# Altium project Enigma Rev A.PrjPCB (part 7 of 10)

## Sheet USB Phy.SchDoc: USB Phy
size Tabloid; ApprovedBy: NA; CompanyName: Cospan Design LLC; DrawnBy: Dave McCoy; Engineer: Dave McCoy; DocumentNumber: 8; Revision: A; SheetNumber: 8; SheetTotal: 20; Client: Public; Project: Enigma; ProjectPrettyName: Enigma
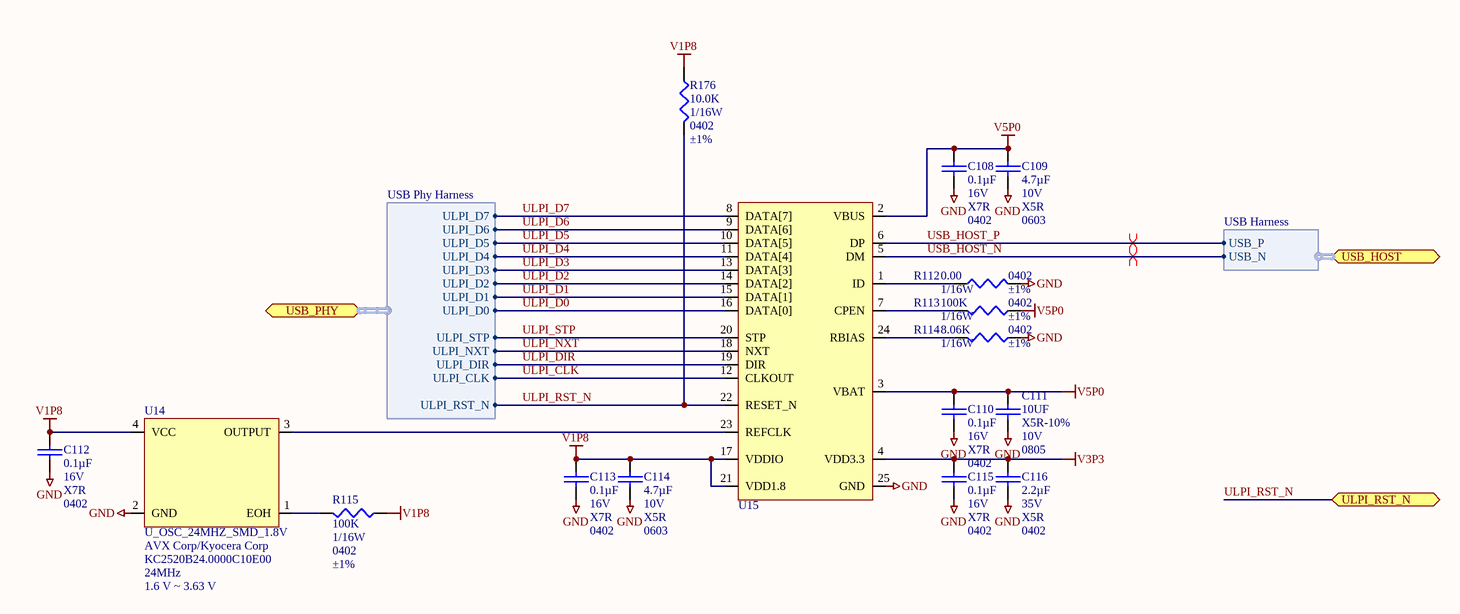
[diagram p13: USB Phy.SchDoc]

### Parts
C108  Capacitance: 0.1µF  Voltage - Rated: 16V  Temperature Coefficient: X7R  Package / Case: 0402  [C_0402]  (hidden comment: 0.1uF)
C109  Voltage - Rated: 10V  Temperature Coefficient: X5R  Package / Case: 0603  [C_ERA-0603]  (hidden comment: 4.7µF)
C110  Capacitance: 0.1µF  Voltage - Rated: 16V  Temperature Coefficient: X7R  Package / Case: 0402  [C_0402]  (hidden comment: 0.1uF)
C111  10UF  TOLERANCE: X5R-10%  VOLTS: 10V  FOOTPRINT: 0805  [C_0805]
C112  Capacitance: 0.1µF  Voltage - Rated: 16V  Temperature Coefficient: X7R  Package / Case: 0402  [C_0402]  (hidden comment: 0.1uF)
C113  Capacitance: 0.1µF  Voltage - Rated: 16V  Temperature Coefficient: X7R  Package / Case: 0402  [C_0402]  (hidden comment: 0.1uF)
C114  Voltage - Rated: 10V  Temperature Coefficient: X5R  Package / Case: 0603  [C_ERA-0603]  (hidden comment: 4.7µF)
C115  Capacitance: 0.1µF  Voltage - Rated: 16V  Temperature Coefficient: X7R  Package / Case: 0402  [C_0402]  (hidden comment: 0.1uF)
C116  Capacitance: 2.2µF  Voltage - Rated: 35V  Temperature Coefficient: X5R  Package / Case: 0402  [C_ERA-0402]  (hidden comment: C_0402_2.2uF_35V)
R112  Resistance In Ohms: 0.00  Power (Watts): 1/16W  Case: 0402  Tolerance: ±1%  [R_0402]  (hidden comment: 0.0 Ohms)
R113  Resistance In Ohms: 100K  Power (Watts): 1/16W  Case: 0402  Tolerance: ±1%  [R_0402]  (hidden comment: R_0402_100K)
R114  Resistance In Ohms: 8.06K  Power (Watts): 1/16W  Case: 0402  Tolerance: ±1%  [R_0402]  (hidden comment: R_0402_8.06K)
R115  Resistance In Ohms: 100K  Power (Watts): 1/16W  Case: 0402  Tolerance: ±1%  [R_0402]  (hidden comment: R_0402_100K)
R176  Resistance In Ohms: 10.0K  Power (Watts): 1/16W  Case: 0402  Tolerance: ±1%  [R_0402]  (hidden comment: R_0402_10.0K)
U14  U_OSC_24MHZ_SMD_1.8V  Manufacturer: AVX Corp/Kyocera Corp  Manufacturer Part Number: KC2520B24.0000C10E00  Frequency: 24MHz  Voltage - Supply: 1.6 V ~ 3.63 V  [OSC_KC5032A]
U15  U_USB3315C  [QFN50P400X400X100_HS-25N]  (value not drawn)

### Ports
ULPI_RST_N, USB_HOST (harness USB Harness), USB_PHY (harness USB Phy Harness)

### Harnesses
USB Phy Harness: ULPI_D7, ULPI_D6, ULPI_D5, ULPI_D4, ULPI_D3, ULPI_D2, ULPI_D1, ULPI_D0, ULPI_STP, ULPI_NXT, ULPI_DIR, ULPI_CLK, ULPI_RST_N
USB Harness: USB_P, USB_N

### Nets
GND: C108.1 C109.1 C110.1 C111.1 C112.1 C113.1 C114.1 C115.1 C116.1 R112.1 R114.2 U14.2(GND) U15.25(GND)
V1P8: C112.2 C113.2 C114.2 R115.2 R176.2 U14.4(VCC) U15.17(VDDIO) U15.21(VDD1.8)
V3P3: C115.2 C116.2 U15.4(VDD3.3)
V5P0: C108.2 C109.2 C110.2 C111.2 R113.2 U15.2(VBUS) U15.3(VBAT)
ULPI_CLK: U15.12(CLKOUT) ; port USB_PHY.ULPI_CLK
ULPI_D0: U15.16(DATA[0]) ; port USB_PHY.ULPI_D0
ULPI_D1: U15.15(DATA[1]) ; port USB_PHY.ULPI_D1
ULPI_D2: U15.14(DATA[2]) ; port USB_PHY.ULPI_D2
ULPI_D3: U15.13(DATA[3]) ; port USB_PHY.ULPI_D3
ULPI_D4: U15.11(DATA[4]) ; port USB_PHY.ULPI_D4
ULPI_D5: U15.10(DATA[5]) ; port USB_PHY.ULPI_D5
ULPI_D6: U15.9(DATA[6]) ; port USB_PHY.ULPI_D6
ULPI_D7: U15.8(DATA[7]) ; port USB_PHY.ULPI_D7
ULPI_DIR: U15.19(DIR) ; port USB_PHY.ULPI_DIR
ULPI_NXT: U15.18(NXT) ; port USB_PHY.ULPI_NXT
ULPI_RST_N: R176.1 U15.22(RESET_N) ; port ULPI_RST_N, port USB_PHY.ULPI_RST_N
ULPI_STP: U15.20(STP) ; port USB_PHY.ULPI_STP
USB_HOST_N: U15.5(DM) ; port USB_HOST.USB_N
USB_HOST_P: U15.6(DP) ; port USB_HOST.USB_P
NetR112_2: R112.2 U15.1(ID)
NetR113_1: R113.1 U15.7(CPEN)
NetR114_1: R114.1 U15.24(RBIAS)
NetR115_1: R115.1 U14.1(EOH)
NetU14_3: U14.3(OUTPUT) U15.23(REFCLK)

### Layout directives
differential pair: USB_HOST_N, USB_HOST_P

### Notes on the sheet
- Project:
- http://www.cospandesign.com
- Cospan Design
- Document:
- Engineer:
- Title:
- Client:
- Approved By:
- Revision:
- Date:
- Number:
- of

### Library data of the parts
C108 C110 C112 C113 C115 = C_0402_0.1UF_16V: as C81 on sheet USB Hub; Supplier 1: Digi-Key; RoHS: RoHS Compliant; Category: Capacitors; Stock 1: 18103134; Pricing 1: 1=0.1, 10=0.014, 100=0.0062, 500=0.00442, 1000=0.00348, 2500=0.00316, 5000=0.00291 (USD); Packaging: Cut Tape (CT); Part Status: Active; Operating Temperature: -55°C ~ 125°C; Features: -; Ratings: -; Applications: General Purpose; Mounting Type: Surface Mount, MLCC; Size / Dimension: 0.039" L x 0.020" W (1.00mm x 0.50mm); Height - Seated (Max): -; Thickness (Max): 0.022" (0.55mm); Lead Spacing: -; ComponentLink1URL: http://www.murata.com/~/media/webrenewal/support/library/catalog/products/capacitor/mlcc/c02e.ashx?la=en-us; ComponentLink1Description: http://www.murata.com/~/media/webrenewal/support/library/catalog/products/capacitor/mlcc/c02e.ashx?la=en-us; Supplier Part Number 1: 490-6328-1-ND
C109 C114 = C_0603_4.7uF_10V: CAP CER 4.7UF 10V X5R 0603; Manufacturer: Murata Electronics North America; Manufacturer Part Number: GRM188R61A475KE15D; Tolerance: ±10%; Supplier 1: Digi-Key; RoHS: RoHS Compliant; Category: Capacitors; Stock 1: 163304; Pricing 1: 1=0.15, 10=0.105, 100=0.0495, 500=0.03472, 1000=0.02875 (USD); Mounting Type: Surface Mount, MLCC; Operating Temperature: -55°C ~ 85°C; Features: Derating Recommended; Applications: General Purpose; Ratings: -; Size / Dimension: 0.063" L x 0.032" W (1.60mm x 0.80mm); Lead Spacing: -; Packaging: Cut Tape (CT); Lead Style: -; ComponentLink1URL: http://search.murata.co.jp/Ceramy/image/img/A01X/G101/ENG/GRM188R61A475KE15-01.pdf; ComponentLink1Description: http://search.murata.co.jp/Ceramy/image/img/A01X/G101/ENG/GRM188R61A475KE15-01.pdf; Supplier Part Number 1: 490-10477-1-ND; Capacitance: 4.7µF; Part Status: Active; Height - Seated (Max): -; Thickness (Max): 0.039" (1.00mm)
C111 = C_0805_10UF_10V: CAP CER 10UF 10V 10% X5R 0805; Manufacturer: Murata Electronics North America; Manufacturer Part Number: GRM21BR61A106KE19L; Capacitance: 10µF; TEMPERATURE: -55/85C; Supplier 1: Digi-Key; Supplier Part Number 1: 490-1709-1-ND; RoHS: RoHS Compliant; Category: Capacitors; Stock 1: 541107; Pricing: 1=0.21, 10=0.144, 50=0.0876, 100=0.0735, 250=0.05952, 500=0.0525, 1000=0.04463 (USD); Packaging: Cut Tape (CT); Voltage - Rated: 10V; Temperature Coefficient: X5R; Mounting Type: Surface Mount, MLCC; Operating Temperature: -55°C ~ 85°C; Applications: General Purpose; Ratings: -; Package / Case: 0805 (2012 Metric); Size / Dimension: 0.079" L x 0.049" W (2.00mm x 1.25mm); Height - Seated (Max): -; Thickness (Max): 0.053" (1.35mm); Lead Spacing: -; Features: -; Lead Style: -; ComponentLink1URL: http://www.murata.com/products/catalog/pdf/c02e.pdf; ComponentLink1Description: http://www.murata.com/products/catalog/pdf/c02e.pdf
C116 = C_0402_2.2uF_35V: CAP CER 2.2UF 35V 20% X5R 0402; Manufacturer: TDK Corporation; Manufacturer Part Number: C1005X5R1V225K050BC; Tolerance: ±10%; Description: CAP CER 2.2UF 35V X5R 0402; Supplier 1: Digi-Key; Supplier Part Number 1: 445-9028-1-ND; RoHS: RoHS Compliant; Category: Capacitors; Stock 1: 300469; Packaging: Cut Tape (CT); Mounting Type: Surface Mount, MLCC; Operating Temperature: -55°C ~ 85°C; Applications: General Purpose; Ratings: -; Size / Dimension: 0.039" L x 0.020" W (1.00mm x 0.50mm); Height - Seated (Max): -; Thickness (Max): 0.022" (0.55mm); Lead Spacing: -; Features: Low ESL; Lead Style: -; ComponentLink1URL: https://product.tdk.com/info/en/catalog/datasheets/mlcc_commercial_general_en.pdf; ComponentLink1Description: https://product.tdk.com/info/en/catalog/datasheets/mlcc_commercial_general_en.pdf; Pricing 1: 1=0.36, 10=0.253, 100=0.1518, 500=0.11386, 1000=0.09614, 2500=0.09108, 5000=0.08602 (USD); Part Status: Active; Failure Rate: -
R112 = R_0402_0.00: RES SMD 0.0OHM JUMPER 1/10W 0402; Manufacturer: Panasonic - ECG; Manufacturer Part Number: ERJ-2GE0R00X; Resistance (Ohms): 0.0; Supplier 1: Digi-Key; Supplier Part Number 1: P0.0JCT-ND; RoHS: RoHS Compliant; Category: Resistors; Stock 1: 9828264; Pricing: 1=0.05, 50=0.0172, 100=0.0131, 250=0.00976, 500=0.0072, 1000=0.0048, 5000=0.00338 (USD); Composition: Thick Film; Features: -; Temperature Coefficient: -; Package / Case: 0402 (1005 Metric); Size / Dimension: 0.039" L x 0.020" W (1.00mm x 0.50mm); Height: 0.016" (0.40mm); Number of Terminations: 2; Packaging: Cut Tape (CT); ComponentLink1URL: http://industrial.panasonic.com/www-cgi/jvcr13pz.cgi?E+PZ+3+AOA0001+ERJ2GE0R00X+7+WW; ComponentLink1Description: http://industrial.panasonic.com/www-cgi/jvcr13pz.cgi?E+PZ+3+AOA0001+ERJ2GE0R00X+7+WW
R113 R115 = R_0402_100K: RES SMD 100K OHM 1% 1/16W 0402; Manufacturer: Yageo; Manufacturer Part Number: RC0402FR-07100KL; Temperature Coefficient: ±100ppm/°C; Supplier 1: Digi-Key; RoHS: RoHS Compliant; Category: Resistors; Stock 1: 4989982; Pricing 1: 1=0.1, 10=0.013, 25=0.0096, 100=0.0054, 250=0.00412, 500=0.00328, 1000=0.00242, 2500=0.0021, 5000=0.00173 (USD); Packaging: Cut Tape (CT); Resistance (Ohms): 100k; Composition: Thick Film; Features: Moisture Resistant; Operating Temperature: -55°C ~ 155°C; Package / Case: 0402 (1005 Metric); Supplier Device Package: 0402; Size / Dimension: 0.039" L x 0.020" W (1.00mm x 0.50mm); Height: 0.016" (0.40mm); Number of Terminations: 2; ComponentLink1URL: http://www.yageo.com/NewPortal/yageodocoutput?fileName=/pdf/R-Chip/PYu-RC_Group_51_RoHS_L_3.pdf; ComponentLink1Description: http://www.yageo.com/NewPortal/yageodocoutput?fileName=/pdf/R-Chip/PYu-RC_Group_51_RoHS_L_3.pdf; Supplier Part Number 1: 311-100KLRCT-ND
R114 = R_0402_8.06K: RES 8.06K OHM 1/16W 1% 0402 SMD; Manufacturer: Yageo; Manufacturer Part Number: RC0402FR-078K06L; Temperature Coefficient: ±100ppm/°C; Supplier 1: Digi-Key; Supplier Part Number 1: 311-8.06KLRCT-ND; RoHS: RoHS Compliant; Category: Resistors; Stock 1: 102694; Pricing: 10=0.014, 50=0.0104, 100=0.0079, 250=0.00584, 500=0.00432, 1000=0.00288 (USD); Resistance (Ohms): 8.06K; Composition: Thick Film; Features: -; Size / Dimension: 0.039" L x 0.020" W (1.00mm x 0.50mm); Height: 0.016" (0.40mm); Number of Terminations: 2; Packaging: Cut Tape (CT); Package / Case: 0402 (1005 Metric); ComponentLink1URL: http://www.yageo.com/documents/recent/PYu-RC0402_51_RoHS_L_6.pdf; ComponentLink1Description: http://www.yageo.com/documents/recent/PYu-RC0402_51_RoHS_L_6.pdf
R176 = R_0402_10.0K: as R87 on sheet USB Hub; Supplier 1: Digi-Key; Supplier Part Number 1: RMCF0402FT10K0CT-ND; RoHS: RoHS Compliant; Category: Resistors; Stock 1: 234525; Pricing: 1=0.04, 10=0.025, 50=0.0138, 100=0.0105, 250=0.0078, 500=0.00576, 1000=0.00384, 2500=0.00324, 5000=0.0027 (USD); Composition: Thick Film; Features: -; Package / Case: 0402 (1005 Metric); Size / Dimension: 0.039" L x 0.020" W (1.00mm x 0.50mm); Height: 0.016" (0.40mm); Number of Terminations: 2; Packaging: Cut Tape (CT); ComponentLink1URL: http://www.seielect.com/Catalog/SEI-RMCF_RMCP.pdf; ComponentLink1Description: http://www.seielect.com/Catalog/SEI-RMCF_RMCP.pdf
U14 = U_OSC_24MHZ_SMD_1.8V: 24MHz CMOS XO (Standard) Oscillator; Function: Standby (Power Down); Frequency Stability: ±50ppm; Current - Supply (Max): 5mA; Current - Supply (Disable) (Max): 10µA; Supplier 1: Digi-Key; RoHS: RoHS Compliant; Category: Crystals, Oscillators, Resonators; Stock 1: 6138; Pricing 1: 1=1.41, 10=1.348, 50=1.3168, 100=1.1286, 500=1.09726, 1000=0.92483 (USD); Packaging: Cut Tape (CT); Part Status: Active; Type: XO (Standard); Output: CMOS; Operating Temperature: -10°C ~ 70°C; Ratings: -; Mounting Type: Surface Mount; Package / Case: 4-SMD, No Lead; Size / Dimension: 0.098" L x 0.079" W (2.50mm x 2.00mm); Height - Seated (Max): 0.028" (0.70mm); ComponentLink1URL: http://global.kyocera.com/prdct/electro/product/pdf/kc2520b_c1_e.pdf; ComponentLink1Description: http://global.kyocera.com/prdct/electro/product/pdf/kc2520b_c1_e.pdf; Supplier Part Number 1: 478-4778-1-ND
U15 = U_USB3315C: IC TXRX USB FLEXPWR 24QFN; Manufacturer: Microchip Technology; Manufacturer Part Number: USB3315C-CP-TR; Protocol: USB 2.0; Number of Drivers/Receivers: 1/1; Voltage - Supply: 1.8 V ~ 3.3 V; Supplier 1: Digi-Key; RoHS: RoHS Compliant; Category: Integrated Circuits (ICs); Stock 1: 12400; Pricing 1: 1=1.28, 25=1.0712, 100=0.9682 (USD); Packaging: Cut Tape (CT); Part Status: Active; Type: Transceiver; Duplex: -; Data Rate: -; Operating Temperature: -40°C ~ 85°C; Mounting Type: Surface Mount; Package / Case: 24-VFQFN Exposed Pad; Supplier Device Package: 24-QFN (4x4); ComponentLink1URL: http://www.microchip.com/mymicrochip/filehandler.aspx?ddocname=en562026; ComponentLink1Description: http://www.microchip.com/mymicrochip/filehandler.aspx?ddocname=en562026; Supplier Part Number 1: USB3315C-CP-CT-ND

## Sheet FMC 400 Pin.SchDoc: Altium FMC Sheet
size A3; Date: 8/14/2017; ApprovedBy: NA; CompanyName: Cospan Design LLC; DrawnBy: Altium; Engineer: Altium; DocumentNumber: 16; Revision: A; SheetNumber: 16; SheetTotal: 20; Project: Enigma; SheetName: Altium FMC Sheet; ProjectPrettyName: Enigma; Client: Public
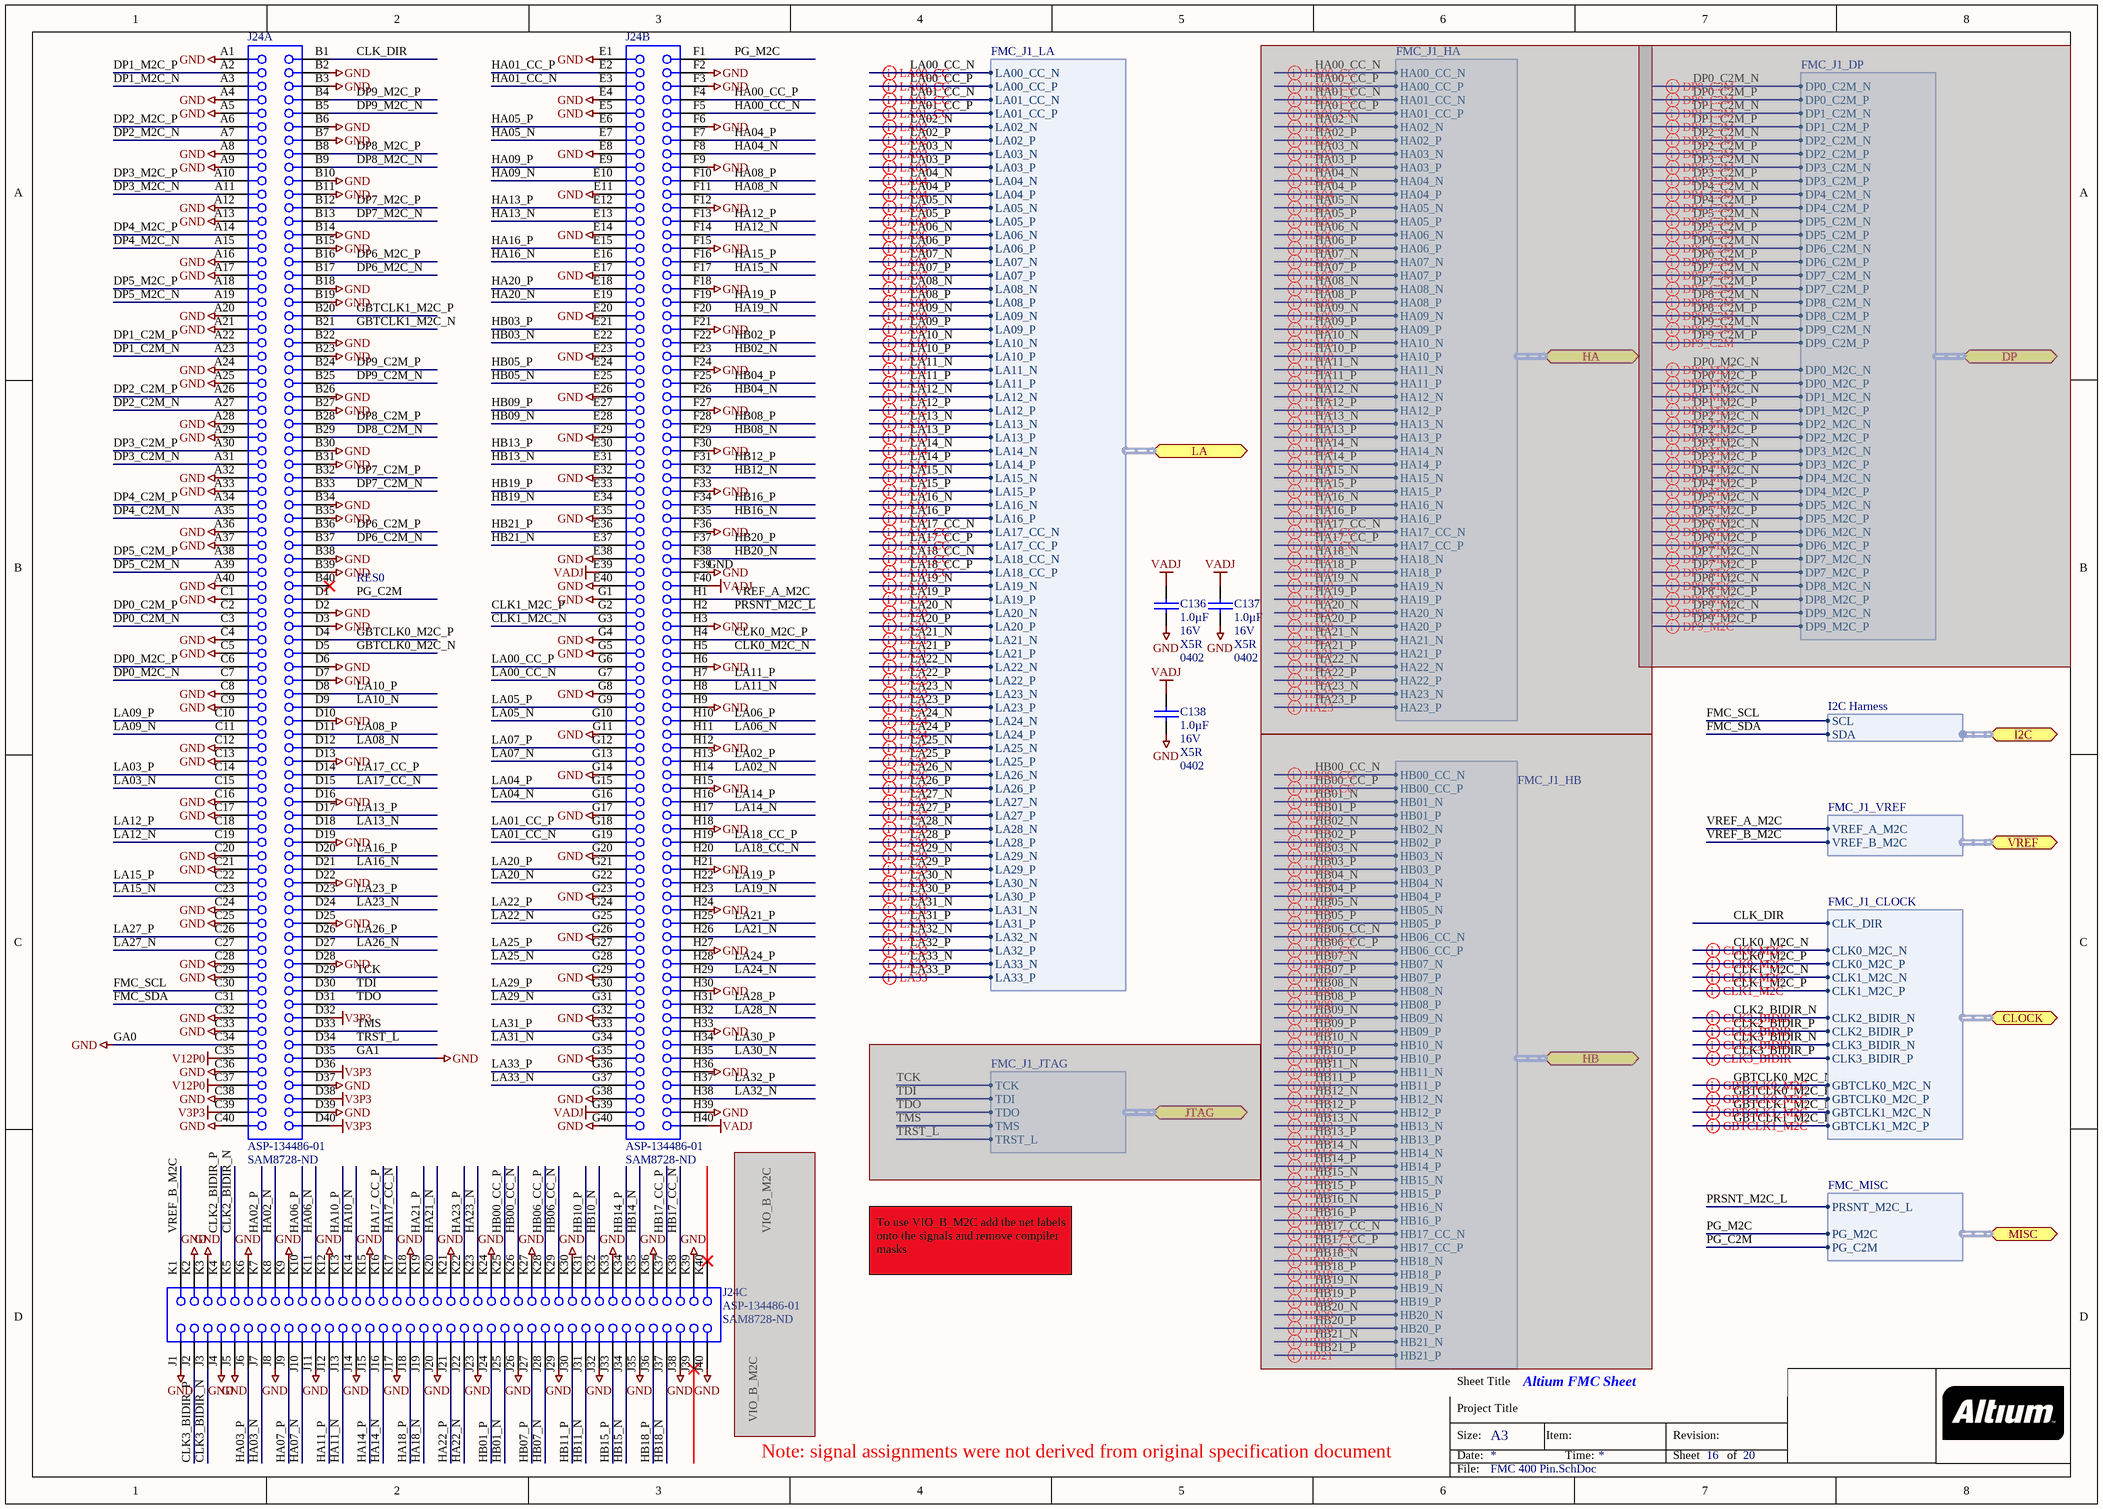
[diagram p14: FMC 400 Pin.SchDoc]

### Parts
C136  Capacitance: 1.0µF  Voltage - Rated: 16V  Temperature Coefficient: X5R  Package / Case: 0402  [C_ERA-0402]  (hidden comment: 1.0uF)
C137  Capacitance: 1.0µF  Voltage - Rated: 16V  Temperature Coefficient: X5R  Package / Case: 0402  [C_ERA-0402]  (hidden comment: 1.0uF)
C138  Capacitance: 1.0µF  Voltage - Rated: 16V  Temperature Coefficient: X5R  Package / Case: 0402  [C_ERA-0402]  (hidden comment: 1.0uF)
J24  ASP-134486-01  Supplier Part Number 1: SAM8728-ND  [BTB-SM1-27-2V400F]  (parts A,B,C of 3)

### Ports
CLOCK (harness FMC_J1_CLOCK), DP (harness FMC_J1_DP), HA (harness FMC_J1_HA), HB (harness FMC_J1_HB), I2C (harness I2C Harness), JTAG (harness FMC_J1_JTAG), LA (harness FMC_J1_LA), MISC (harness FMC_MISC), VREF (harness FMC_J1_VREF)

### Harnesses
FMC_J1_DP: DP1_C2M_N, DP1_C2M_P, DP1_M2C_N, DP1_M2C_P, DP2_C2M_N, DP2_C2M_P, DP2_M2C_N, DP2_M2C_P, DP3_C2M_N, DP3_C2M_P, DP3_M2C_N, DP3_M2C_P, DP4_C2M_N, DP4_C2M_P, DP4_M2C_N, DP4_M2C_P, DP5_C2M_N, DP5_C2M_P, DP5_M2C_N, DP5_M2C_P, DP6_C2M_N, DP6_C2M_P, DP6_M2C_N, DP6_M2C_P, DP7_C2M_N, DP7_C2M_P, DP7_M2C_N, DP7_M2C_P, DP8_C2M_N, DP8_C2M_P, DP8_M2C_N, DP8_M2C_P, DP9_C2M_N, DP9_C2M_P, DP9_M2C_N, DP9_M2C_P, DP0_C2M_N, DP0_C2M_P, DP0_M2C_N, DP0_M2C_P
FMC_J1_LA: LA05_N, LA05_P, LA06_N, LA06_P, LA09_N, LA09_P, LA10_N, LA10_P, LA13_N, LA13_P, LA14_N, LA14_P, LA23_N, LA23_P, LA26_N, LA26_P, LA27_N, LA27_P, LA02_N, LA02_P, LA03_N, LA03_P, LA04_N, LA04_P, LA07_N, LA07_P, LA08_N, LA08_P, LA11_N, LA11_P, LA12_N, LA12_P, LA15_N, LA15_P, LA16_N, LA16_P, LA19_N, LA19_P, LA20_N, LA20_P, LA21_N, LA21_P, LA22_N, LA22_P, LA24_N, LA24_P, LA25_N, LA25_P, LA28_N, LA28_P, LA29_N, LA29_P, LA30_N, LA30_P, LA31_N, LA31_P, LA32_N, LA32_P, LA33_N, LA33_P, LA00_CC_N, LA00_CC_P, LA01_CC_N, LA01_CC_P, LA17_CC_N, LA17_CC_P, LA18_CC_N, LA18_CC_P
FMC_J1_HA: HA04_N, HA04_P, HA05_N, HA05_P, HA08_N, HA08_P, HA09_N, HA09_P, HA12_N, HA12_P, HA13_N, HA13_P, HA15_N, HA15_P, HA16_N, HA16_P, HA19_N, HA19_P, HA20_N, HA20_P, HA02_N, HA02_P, HA03_N, HA03_P, HA06_N, HA06_P, HA07_N, HA07_P, HA10_N, HA10_P, HA11_N, HA11_P, HA14_N, HA14_P, HA18_N, HA18_P, HA21_N, HA21_P, HA22_N, HA22_P, HA23_N, HA23_P, HA17_CC_N, HA17_CC_P, HA00_CC_N, HA00_CC_P, HA01_CC_N, HA01_CC_P
FMC_J1_HB: HB02_N, HB02_P, HB03_N, HB03_P, HB04_N, HB04_P, HB05_N, HB05_P, HB08_N, HB08_P, HB09_N, HB09_P, HB12_N, HB12_P, HB13_N, HB13_P, HB16_N, HB16_P, HB19_N, HB19_P, HB20_N, HB20_P, HB21_N, HB21_P, HB01_N, HB01_P, HB07_N, HB07_P, HB10_N, HB10_P, HB11_N, HB11_P, HB14_N, HB14_P, HB15_N, HB15_P, HB18_N, HB18_P, HB17_CC_N, HB17_CC_P, HB06_CC_N, HB06_CC_P, HB00_CC_N, HB00_CC_P
FMC_MISC: PRSNT_M2C_L, PG_M2C, PG_C2M
FMC_J1_JTAG: TCK, TDI, TDO, TMS, TRST_L
FMC_J1_CLOCK: CLK2_BIDIR_N, CLK2_BIDIR_P, CLK3_BIDIR_N, CLK3_BIDIR_P, CLK0_M2C_N, CLK0_M2C_P, CLK1_M2C_N, CLK1_M2C_P, CLK_DIR, GBTCLK0_M2C_N, GBTCLK0_M2C_P, GBTCLK1_M2C_N, GBTCLK1_M2C_P
FMC_J1_VREF: VREF_A_M2C, VREF_B_M2C
I2C Harness: SCL, SDA

### Nets
GND: C136.1 C137.1 C138.1 J24.A1 J24.A4 J24.A5 J24.A8 J24.A9 J24.A12 J24.A13 J24.A16 J24.A17 J24.A20 J24.A21 J24.A24 J24.A25 J24.A28 J24.A29 J24.A32 J24.A33 J24.A36 J24.A37 J24.A40 J24.B2 J24.B3 J24.B6 J24.B7 J24.B10 J24.B11 J24.B14 J24.B15 J24.B18 J24.B19 J24.B22 J24.B23 J24.B26 J24.B27 J24.B30 J24.B31 J24.B34 J24.B35 J24.B38 J24.B39 J24.C1 J24.C4 J24.C5 J24.C8 J24.C9 J24.C12 J24.C13 J24.C16 J24.C17 J24.C20 J24.C21 J24.C24 J24.C25 J24.C28 J24.C29 J24.C32 J24.C33 J24.C34 J24.C36 J24.C38 J24.C40 J24.D2 J24.D3 J24.D6 J24.D7 J24.D10 J24.D13 J24.D16 J24.D19 J24.D22 J24.D25 J24.D28 J24.D35 J24.D37 J24.D39 J24.E1 J24.E4 J24.E5 J24.E8 J24.E11 J24.E14 J24.E17 J24.E20 J24.E23 J24.E26 J24.E29 J24.E32 J24.E35 J24.E38 J24.E40 J24.F2 J24.F3 J24.F6 J24.F9 J24.F12 J24.F15 J24.F18 J24.F21 J24.F24 J24.F27 J24.F30 J24.F33 J24.F36 J24.F39 J24.G1 J24.G4 J24.G5 J24.G8 J24.G11 J24.G14 J24.G17 J24.G20 J24.G23 J24.G26 J24.G29 J24.G32 J24.G35 J24.G38 J24.G40 J24.H3 J24.H6 J24.H9 J24.H12 J24.H15 J24.H18 J24.H21 J24.H24 J24.H27 J24.H30 J24.H33 J24.H36 J24.H39 J24.J1 J24.J4 J24.J5 J24.J8 J24.J11 J24.J14 J24.J17 J24.J20 J24.J23 J24.J26 J24.J29 J24.J32 J24.J35 J24.J38 J24.J40 J24.K2 J24.K3 J24.K6 J24.K9 J24.K12 J24.K15 J24.K18 J24.K21 J24.K24 J24.K27 J24.K30 J24.K33 J24.K36 J24.K39  [also labelled GA0, GA1]
V3P3: J24.C39 J24.D32 J24.D36 J24.D38 J24.D40
V12P0: J24.C35 J24.C37
VADJ: C136.2 C137.2 C138.2 J24.E39 J24.F40 J24.G39 J24.H1 J24.H40 ; port VREF.VREF_A_M2C  [also labelled VREF_A_M2C]
CLK0_M2C_N: J24.H5 ; port CLOCK.CLK0_M2C_N
CLK0_M2C_P: J24.H4 ; port CLOCK.CLK0_M2C_P
CLK1_M2C_N: J24.G3 ; port CLOCK.CLK1_M2C_N
CLK1_M2C_P: J24.G2 ; port CLOCK.CLK1_M2C_P
CLK2_BIDIR_N: J24.K5 ; port CLOCK.CLK2_BIDIR_N
CLK2_BIDIR_P: J24.K4 ; port CLOCK.CLK2_BIDIR_P
CLK3_BIDIR_N: J24.J3 ; port CLOCK.CLK3_BIDIR_N
CLK3_BIDIR_P: J24.J2 ; port CLOCK.CLK3_BIDIR_P
CLK_DIR: J24.B1 ; port CLOCK.CLK_DIR
DP0_C2M_N: J24.C3
DP0_C2M_P: J24.C2
DP0_M2C_N: J24.C7
DP0_M2C_P: J24.C6
DP1_C2M_N: J24.A23
DP1_C2M_P: J24.A22
DP1_M2C_N: J24.A3
DP1_M2C_P: J24.A2
DP2_C2M_N: J24.A27
DP2_C2M_P: J24.A26
DP2_M2C_N: J24.A7
DP2_M2C_P: J24.A6
DP3_C2M_N: J24.A31
DP3_C2M_P: J24.A30
DP3_M2C_N: J24.A11
DP3_M2C_P: J24.A10
DP4_C2M_N: J24.A35
DP4_C2M_P: J24.A34
DP4_M2C_N: J24.A15
DP4_M2C_P: J24.A14
DP5_C2M_N: J24.A39
DP5_C2M_P: J24.A38
DP5_M2C_N: J24.A19
DP5_M2C_P: J24.A18
DP6_C2M_N: J24.B37
DP6_C2M_P: J24.B36
DP6_M2C_N: J24.B17
DP6_M2C_P: J24.B16
DP7_C2M_N: J24.B33
DP7_C2M_P: J24.B32
DP7_M2C_N: J24.B13
DP7_M2C_P: J24.B12
DP8_C2M_N: J24.B29
DP8_C2M_P: J24.B28
DP8_M2C_N: J24.B9
DP8_M2C_P: J24.B8
DP9_C2M_N: J24.B25
DP9_C2M_P: J24.B24
DP9_M2C_N: J24.B5
DP9_M2C_P: J24.B4
FMC_SCL: J24.C30 ; port I2C.SCL
FMC_SDA: J24.C31 ; port I2C.SDA
GBTCLK0_M2C_N: J24.D5 ; port CLOCK.GBTCLK0_M2C_N
GBTCLK0_M2C_P: J24.D4 ; port CLOCK.GBTCLK0_M2C_P
GBTCLK1_M2C_N: J24.B21 ; port CLOCK.GBTCLK1_M2C_N
GBTCLK1_M2C_P: J24.B20 ; port CLOCK.GBTCLK1_M2C_P
HA00_CC_N: J24.F5
HA00_CC_P: J24.F4
HA01_CC_N: J24.E3
HA01_CC_P: J24.E2
HA02_N: J24.K8
HA02_P: J24.K7
HA03_N: J24.J7
HA03_P: J24.J6
HA04_N: J24.F8
HA04_P: J24.F7
HA05_N: J24.E7
HA05_P: J24.E6
HA06_N: J24.K11
HA06_P: J24.K10
HA07_N: J24.J10
HA07_P: J24.J9
HA08_N: J24.F11
HA08_P: J24.F10
HA09_N: J24.E10
HA09_P: J24.E9
HA10_N: J24.K14
HA10_P: J24.K13
HA11_N: J24.J13
HA11_P: J24.J12
HA12_N: J24.F14
HA12_P: J24.F13
HA13_N: J24.E13
HA13_P: J24.E12
HA14_N: J24.J16
HA14_P: J24.J15
HA15_N: J24.F17
HA15_P: J24.F16
HA16_N: J24.E16
HA16_P: J24.E15
HA17_CC_N: J24.K17
HA17_CC_P: J24.K16
HA18_N: J24.J19
HA18_P: J24.J18
HA19_N: J24.F20
HA19_P: J24.F19
HA20_N: J24.E19
HA20_P: J24.E18
HA21_N: J24.K20
HA21_P: J24.K19
HA22_N: J24.J22
HA22_P: J24.J21
HA23_N: J24.K23
HA23_P: J24.K22
HB00_CC_N: J24.K26
HB00_CC_P: J24.K25
HB01_N: J24.J25
HB01_P: J24.J24
HB02_N: J24.F23
HB02_P: J24.F22
HB03_N: J24.E22
HB03_P: J24.E21
HB04_N: J24.F26
HB04_P: J24.F25
HB05_N: J24.E25
HB05_P: J24.E24
HB06_CC_N: J24.K29
HB06_CC_P: J24.K28
HB07_N: J24.J28
HB07_P: J24.J27
HB08_N: J24.F29
HB08_P: J24.F28
HB09_N: J24.E28
HB09_P: J24.E27
HB10_N: J24.K32
HB10_P: J24.K31
HB11_N: J24.J31
HB11_P: J24.J30
HB12_N: J24.F32
HB12_P: J24.F31
HB13_N: J24.E31
HB13_P: J24.E30
HB14_N: J24.K35
HB14_P: J24.K34
HB15_N: J24.J34
HB15_P: J24.J33
HB16_N: J24.F35
HB16_P: J24.F34
HB17_CC_N: J24.K38
HB17_CC_P: J24.K37
HB18_N: J24.J37
HB18_P: J24.J36
HB19_N: J24.E34
HB19_P: J24.E33
HB20_N: J24.F38
HB20_P: J24.F37
HB21_N: J24.E37
HB21_P: J24.E36
LA00_CC_N: J24.G7 ; port LA.LA00_CC_N
LA00_CC_P: J24.G6 ; port LA.LA00_CC_P
LA01_CC_N: J24.G19 ; port LA.LA01_CC_N
LA01_CC_P: J24.G18 ; port LA.LA01_CC_P
LA02_N: J24.H14 ; port LA.LA02_N
LA02_P: J24.H13 ; port LA.LA02_P
LA03_N: J24.C15 ; port LA.LA03_N
LA03_P: J24.C14 ; port LA.LA03_P
LA04_N: J24.G16 ; port LA.LA04_N
LA04_P: J24.G15 ; port LA.LA04_P
LA05_N: J24.G10 ; port LA.LA05_N
LA05_P: J24.G9 ; port LA.LA05_P
LA06_N: J24.H11 ; port LA.LA06_N
LA06_P: J24.H10 ; port LA.LA06_P
LA07_N: J24.G13 ; port LA.LA07_N
LA07_P: J24.G12 ; port LA.LA07_P
LA08_N: J24.D12 ; port LA.LA08_N
LA08_P: J24.D11 ; port LA.LA08_P
LA09_N: J24.C11 ; port LA.LA09_N
LA09_P: J24.C10 ; port LA.LA09_P
LA10_N: J24.D9 ; port LA.LA10_N
LA10_P: J24.D8 ; port LA.LA10_P
LA11_N: J24.H8 ; port LA.LA11_N
LA11_P: J24.H7 ; port LA.LA11_P
LA12_N: J24.C19 ; port LA.LA12_N
LA12_P: J24.C18 ; port LA.LA12_P
LA13_N: J24.D18 ; port LA.LA13_N
LA13_P: J24.D17 ; port LA.LA13_P
LA14_N: J24.H17 ; port LA.LA14_N
LA14_P: J24.H16 ; port LA.LA14_P
LA15_N: J24.C23 ; port LA.LA15_N
LA15_P: J24.C22 ; port LA.LA15_P
LA16_N: J24.D21 ; port LA.LA16_N
LA16_P: J24.D20 ; port LA.LA16_P
LA17_CC_N: J24.D15 ; port LA.LA17_CC_N
LA17_CC_P: J24.D14 ; port LA.LA17_CC_P
LA18_CC_N: J24.H20 ; port LA.LA18_CC_N
LA18_CC_P: J24.H19 ; port LA.LA18_CC_P
LA19_N: J24.H23 ; port LA.LA19_N
LA19_P: J24.H22 ; port LA.LA19_P
LA20_N: J24.G22 ; port LA.LA20_N
LA20_P: J24.G21 ; port LA.LA20_P
LA21_N: J24.H26 ; port LA.LA21_N
LA21_P: J24.H25 ; port LA.LA21_P
LA22_N: J24.G25 ; port LA.LA22_N
LA22_P: J24.G24 ; port LA.LA22_P
LA23_N: J24.D24 ; port LA.LA23_N
LA23_P: J24.D23 ; port LA.LA23_P
LA24_N: J24.H29 ; port LA.LA24_N
LA24_P: J24.H28 ; port LA.LA24_P
LA25_N: J24.G28 ; port LA.LA25_N
LA25_P: J24.G27 ; port LA.LA25_P
LA26_N: J24.D27 ; port LA.LA26_N
LA26_P: J24.D26 ; port LA.LA26_P
LA27_N: J24.C27 ; port LA.LA27_N
LA27_P: J24.C26 ; port LA.LA27_P
LA28_N: J24.H32 ; port LA.LA28_N
LA28_P: J24.H31 ; port LA.LA28_P
LA29_N: J24.G31 ; port LA.LA29_N
LA29_P: J24.G30 ; port LA.LA29_P
LA30_N: J24.H35 ; port LA.LA30_N
LA30_P: J24.H34 ; port LA.LA30_P
LA31_N: J24.G34 ; port LA.LA31_N
LA31_P: J24.G33 ; port LA.LA31_P
LA32_N: J24.H38 ; port LA.LA32_N
LA32_P: J24.H37 ; port LA.LA32_P
LA33_N: J24.G37 ; port LA.LA33_N
LA33_P: J24.G36 ; port LA.LA33_P
PG_C2M: J24.D1 ; port MISC.PG_C2M
PG_M2C: J24.F1 ; port MISC.PG_M2C
PRSNT_M2C_L: J24.H2 ; port MISC.PRSNT_M2C_L
TCK: J24.D29
TDI: J24.D30
TDO: J24.D31
TMS: J24.D33
TRST_L: J24.D34
VREF_B_M2C: J24.K1 ; port VREF.VREF_B_M2C

Not connected (* = marked no-connect by the designer): J24 B40* J39* K40*

### Layout directives
differential pair: (no net found under the mark), CLK0_M2C_N, CLK0_M2C_P, CLK1_M2C_N, CLK1_M2C_P, CLK2_BIDIR_N, CLK2_BIDIR_P, CLK3_BIDIR_N, CLK3_BIDIR_P, GBTCLK0_M2C_N, GBTCLK0_M2C_P, GBTCLK1_M2C_N, GBTCLK1_M2C_P, LA00_CC_N, LA00_CC_P, LA01_CC_N, LA01_CC_P, LA02_N, LA02_P, LA03_N, LA03_P, LA04_N, LA04_P, LA05_N, LA05_P, LA06_N, LA06_P, LA07_N, LA07_P, LA08_N, LA08_P, LA09_N, LA09_P, LA10_N, LA10_P, LA11_N, LA11_P, LA12_N, LA12_P, LA13_N, LA13_P, LA14_N, LA14_P, LA15_N, LA15_P, LA16_N, LA16_P, LA17_CC_N, LA17_CC_P, LA18_CC_N, LA18_CC_P, LA19_N, LA19_P, LA20_N, LA20_P, LA21_N, LA21_P, LA22_N, LA22_P, LA23_N, LA23_P, LA24_N, LA24_P, LA25_N, LA25_P, LA26_N, LA26_P, LA27_N, LA27_P, LA28_N, LA28_P, LA29_N, LA29_P, LA30_N, LA30_P, LA31_N, LA31_P, LA32_N, LA32_P, LA33_N, LA33_P

### Notes on the sheet
- RES0
- To use VIO_B_M2C add the net labels onto the signals and remove compiler masks
- Note: signal assignments were not derived from original specification document
- Sheet Title
- Project Title
- Size:
- Date:
- A3
- Item:
- Time:
- Revision:
- Sheet
- of
- File:

### Library data of the parts
C136-C138 = C_0402_1.0UF_16V: CAP CER 1.0UF 16V X5R 0402; Manufacturer: Taiyo Yuden; Manufacturer Part Number: EMK105BJ105KV-F; Tolerance: ±10%; Description: CAP CER 1UF 16V X5R 0402; Supplier 1: Digi-Key; RoHS: RoHS Compliant; Category: Capacitors; Stock 1: 489909; Pricing 1: 1=0.1, 10=0.063, 100=0.028, 500=0.01998, 1000=0.0157, 2500=0.01427, 5000=0.01313 (USD); Packaging: Cut Tape (CT); Part Status: Active; Operating Temperature: -55°C ~ 85°C; Features: -; Ratings: -; Applications: General Purpose; Mounting Type: Surface Mount, MLCC; Size / Dimension: 0.039" L x 0.020" W (1.00mm x 0.50mm); Height - Seated (Max): -; Thickness (Max): 0.022" (0.55mm); Lead Spacing: -; Lead Style: -; ComponentLink1URL: http://ds.yuden.co.jp/TYCOMPAS/ut/detail.do?productNo=EMK105BJ105KV-F&fileName=EMK105BJ105KV-F_SS&mode=specSheetDownload; ComponentLink1Description: http://ds.yuden.co.jp/TYCOMPAS/ut/detail.do?productNo=EMK105BJ105KV-F&fileName=EMK105BJ105KV-F_SS&mode=specSheetDownload; Supplier Part Number 1: 587-2477-1-ND
J24 = J_ASP-134486-01: CONN SNGL-END ARRAY FMALE 400POS; Manufacturer: Samtec Inc.; Connector Type: Array, Female Sockets; Number of Positions: 400; Pitch: 0.050" (1.27mm); Supplier 1: Digi-Key; Manufacturer Part Number: ASP-134486-01; RoHS: RoHS Compliant; Category: Connectors, Interconnects; Stock 1: 64; Pricing 1: 1=20.4, 10=19.67, 25=18.9412, 50=18.5768, 100=18.2125, 250=17.84824, 500=17.484 (USD); Packaging: Tape & Reel (TR); Part Status: Active; Number of Rows: 10; Mounting Type: Surface Mount; Features: Board Guide; Contact Finish: Gold; Contact Finish Thickness: 30µin (0.76µm); Mated Stacking Heights: -; Height Above Board: 0.258" (6.55mm)

## Sheet Power.SchDoc: Power
size Tabloid; ApprovedBy: NA; CompanyName: Cospan Design LLC; DrawnBy: Dave McCoy; Engineer: Dave McCoy; DocumentNumber: 17; Revision: A; SheetNumber: 17; SheetTotal: 20; Client: Public; Project: Enigma; ProjectPrettyName: Enigma
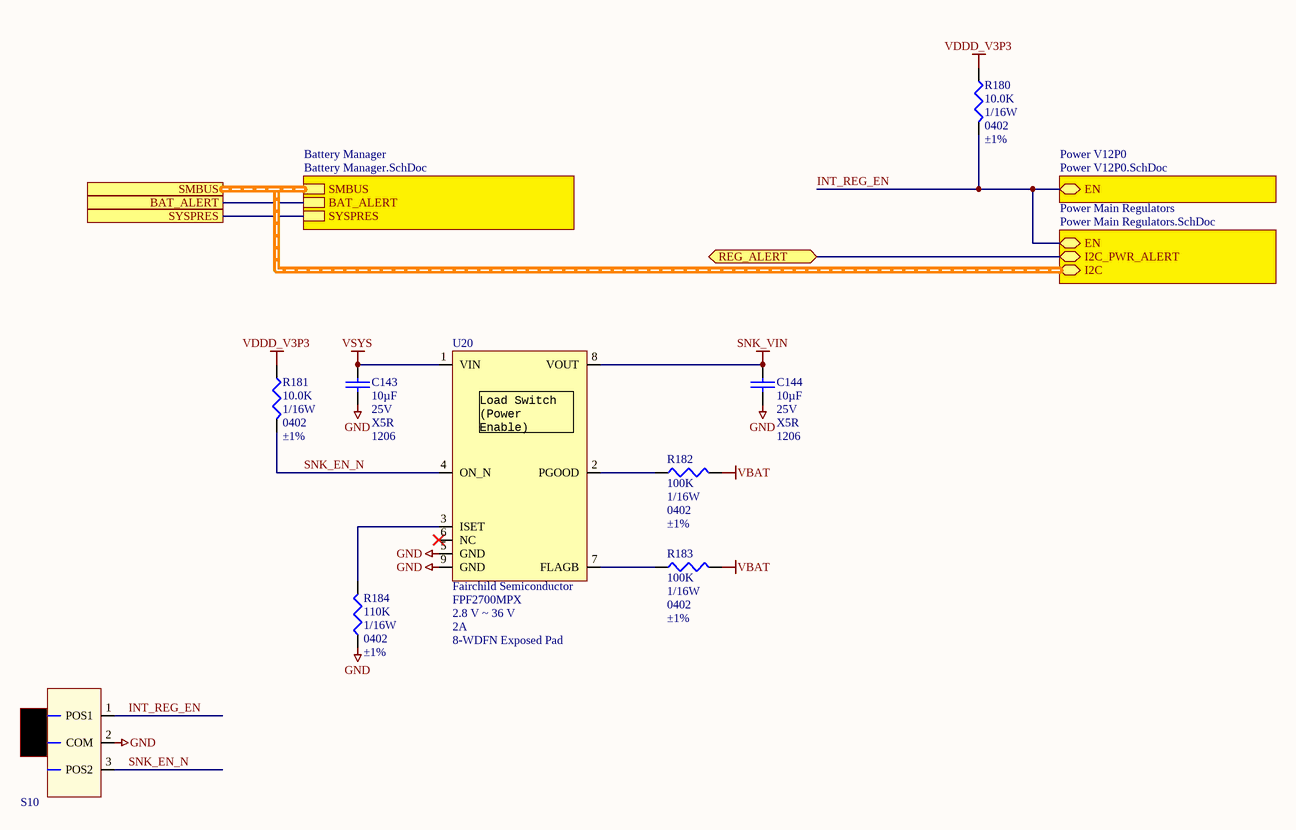
[diagram p15: Power.SchDoc]

### Parts
C143  Voltage - Rated: 25V  Temperature Coefficient: X5R  Package / Case: 1206  [CAP-1206]  (hidden comment: 10µF)
C144  Voltage - Rated: 25V  Temperature Coefficient: X5R  Package / Case: 1206  [CAP-1206]  (hidden comment: 10µF)
R180  Resistance In Ohms: 10.0K  Power (Watts): 1/16W  Case: 0402  Tolerance: ±1%  [R_0402]  (hidden comment: R_0402_10.0K)
R181  Resistance In Ohms: 10.0K  Power (Watts): 1/16W  Case: 0402  Tolerance: ±1%  [R_0402]  (hidden comment: R_0402_10.0K)
R182  Resistance In Ohms: 100K  Power (Watts): 1/16W  Case: 0402  Tolerance: ±1%  [R_0402]  (hidden comment: R_0402_100K)
R183  Resistance In Ohms: 100K  Power (Watts): 1/16W  Case: 0402  Tolerance: ±1%  [R_0402]  (hidden comment: R_0402_100K)
R184  Power (Watts): 1/16W  Case: 0402  Tolerance: ±1%  [R_0402]  (hidden comment: 110K)
S10  Micro Slide Switch  [PCM_SMD_SWITCH]  (value not drawn)
U20  Manufacturer: Fairchild Semiconductor  Manufacturer Part Number: FPF2700MPX  Voltage - Load: 2.8 V ~ 36 V  Current - Output (Max): 2A  Package / Case: 8-WDFN Exposed Pad  [SON65P300X80_HS-9N]  (hidden comment: U_FPF2700MPX)

### Sub-sheets
Battery Manager = Battery Manager.SchDoc: SMBUS (harness I2C Harness), BAT_ALERT, SYSPRES
Power Main Regulators = Power Main Regulators.SchDoc: I2C_PWR_ALERT, EN, I2C (harness I2C Harness)
Power V12P0 = Power V12P0.SchDoc: EN

### Ports
BAT_ALERT, REG_ALERT, SMBUS (harness I2C Harness), SYSPRES

### Nets
GND: C143.1 C144.1 R184.2 S10.2(COM) U20.5(GND) U20.9(GND)
SNK_VIN: C144.2 U20.8(VOUT)
VBAT: R182.1 R183.1
VDDD_V3P3: R180.2 R181.2
VSYS: C143.2 U20.1(VIN)
ALERT: port BAT_ALERT, sheet Battery Manager/BAT_ALERT
INT_REG_EN: R180.1 S10.1(POS1) ; sheet Power V12P0/EN, sheet Power Main Regulators/EN
SNK_EN_N: R181.1 S10.3(POS2) U20.4(ON_N)
SYSPRES: port SYSPRES, sheet Battery Manager/SYSPRES
NetR182_2: R182.2 U20.2(PGOOD)
NetR183_2: R183.2 U20.7(FLAGB)
NetR184_1: R184.1 U20.3(ISET)
NetT2_1: port REG_ALERT, sheet Power Main Regulators/I2C_PWR_ALERT

Not connected (* = marked no-connect by the designer): U20 6(NC)*

### Buses and harness runs
harness port SMBUS = sheet Battery Manager/SMBUS = sheet Power Main Regulators/I2C

### Notes on the sheet
- Project:
- http://www.cospandesign.com
- Cospan Design
- Document:
- Engineer:
- Title:
- Client:
- Approved By:
- Revision:
- Date:
- Number:
- of
- (in symbol U_FPF2700MPX) Load Switch / (Power Enable)

### Library data of the parts
C143 C144 = C_1206_10UF_25V: CAP CER 10UF 25V X5R 1206; Manufacturer: Murata Electronics North America; Manufacturer Part Number: GRM31CR61E106MA12L; Tolerance: ±20%; Supplier 1: Digi-Key; Supplier Part Number 1: 490-5423-1-ND; RoHS: RoHS Compliant; Category: Capacitors; Stock 1: 359069; Pricing: 1=0.51, 10=0.402, 50=0.2646, 100=0.2099, 250=0.15512, 500=0.12046, 1000=0.0949 (USD); Mounting Type: Surface Mount, MLCC; Operating Temperature: -55°C ~ 85°C; Applications: General Purpose; Ratings: -; Size / Dimension: 0.126" L x 0.063" W (3.20mm x 1.60mm); Height: -; Thickness: 0.071" (1.80mm); Lead Spacing: -; Features: -; Packaging: Cut Tape (CT); Lead Style: -; ComponentLink1URL: http://search.murata.co.jp/Ceramy/image/img/PDF/ENG/GRM31CR61E106MA12.pdf; ComponentLink1Description: http://search.murata.co.jp/Ceramy/image/img/PDF/ENG/GRM31CR61E106MA12.pdf; Capacitance: 10µF
R180 R181 = R_0402_10.0K: as R87 on sheet USB Hub; Supplier 1: Digi-Key; Supplier Part Number 1: RMCF0402FT10K0CT-ND; RoHS: RoHS Compliant; Category: Resistors; Stock 1: 234525; Pricing: 1=0.04, 10=0.025, 50=0.0138, 100=0.0105, 250=0.0078, 500=0.00576, 1000=0.00384, 2500=0.00324, 5000=0.0027 (USD); Composition: Thick Film; Features: -; Package / Case: 0402 (1005 Metric); Size / Dimension: 0.039" L x 0.020" W (1.00mm x 0.50mm); Height: 0.016" (0.40mm); Number of Terminations: 2; Packaging: Cut Tape (CT); ComponentLink1URL: http://www.seielect.com/Catalog/SEI-RMCF_RMCP.pdf; ComponentLink1Description: http://www.seielect.com/Catalog/SEI-RMCF_RMCP.pdf
R182 R183 = R_0402_100K: as R113 on sheet USB Phy; Supplier 1: Digi-Key; RoHS: RoHS Compliant; Category: Resistors; Stock 1: 4989982; Pricing 1: 1=0.1, 10=0.013, 25=0.0096, 100=0.0054, 250=0.00412, 500=0.00328, 1000=0.00242, 2500=0.0021, 5000=0.00173 (USD); Packaging: Cut Tape (CT); Resistance (Ohms): 100k; Composition: Thick Film; Features: Moisture Resistant; Operating Temperature: -55°C ~ 155°C; Package / Case: 0402 (1005 Metric); Supplier Device Package: 0402; Size / Dimension: 0.039" L x 0.020" W (1.00mm x 0.50mm); Height: 0.016" (0.40mm); Number of Terminations: 2; ComponentLink1URL: http://www.yageo.com/NewPortal/yageodocoutput?fileName=/pdf/R-Chip/PYu-RC_Group_51_RoHS_L_3.pdf; ComponentLink1Description: http://www.yageo.com/NewPortal/yageodocoutput?fileName=/pdf/R-Chip/PYu-RC_Group_51_RoHS_L_3.pdf; Supplier Part Number 1: 311-100KLRCT-ND
R184 = R_0402_110K: RES 110K OHM 1/10W 1% 0402 SMD; Manufacturer: Panasonic Electronic Components; Manufacturer Part Number: ERJ-2RKF1103X; Temperature Coefficient: ±100ppm/°C; Supplier 1: Digi-Key; Supplier Part Number 1: P110KLCT-ND; RoHS: RoHS Compliant; Category: Resistors; Stock 1: 125624; Pricing: 1=0.1, 50=0.0242, 100=0.0184, 250=0.01364, 500=0.01008, 1000=0.00672, 5000=0.00473 (USD); Packaging: Cut Tape (CT); Resistance (Ohms): 110k; Composition: Thick Film; Features: -; Package / Case: 0402 (1005 Metric); Supplier Device Package: 0402; Size / Dimension: 0.039" L x 0.020" W (1.00mm x 0.50mm); Height: 0.016" (0.40mm); Number of Terminations: 2; ComponentLink1URL: http://industrial.panasonic.com/www-cgi/jvcr13pz.cgi?E+PZ+3+AOA0002+ERJ2RKF1103X+7+WW; ComponentLink1Description: http://industrial.panasonic.com/www-cgi/jvcr13pz.cgi?E+PZ+3+AOA0002+ERJ2RKF1103X+7+WW; Resistance In Ohms: 110K
S10 = S_MICRO_SLIDE_SWITCH_ON_OFF: SWITCH SLIDE SPDT 300MA 6V; Manufacturer: C&K Components; Manufacturer Part Number: PCM12SMTR; Contact Timing: Not Specified; Switch Function: On-On; Current Rating: 300mA (DC); Actuator Type: Standard; Actuator Length: 1.50mm; Actuator Material: Polyamide (PA46), Nylon 4/6; Mechanical Life: 10,000 Cycles; Supplier 1: Digi-Key; RoHS: RoHS Compliant; Category: Switches; Stock 1: 29326; Pricing 1: 1=0.82, 10=0.787, 25=0.7704, 50=0.6884, 100=0.6556, 250=0.6392, 500=0.54088, 1000=0.52448 (USD); Packaging: Cut Tape (CT); Circuit: SPDT; Voltage Rating - AC: -; Voltage Rating - DC: 6V; Contact Material: Copper Alloy; Contact Finish: Silver; Mounting Type: Surface Mount, Right Angle; Termination Style: Gull Wing; Features: -; Switch Travel: 1.50mm; Operating Temperature: -20°C ~ 85°C; Electrical Life: -; Operating Force: -; ComponentLink1URL: http://www.ck-components.com/index.php?module=media&action=Display&cmpref=14389&lang=en&width=&height=&format=&alt=; ComponentLink1Description: http://www.ck-components.com/index.php?module=media&action=Display&cmpref=14389&lang=en&width=&height=&format=&alt=; Supplier Part Number 1: 401-2016-1-ND
U20 = U_FPF2700MPX: IC LOAD SWITCH CURR LIMIT 8-MLP; Switch Type: General Purpose; Number of Outputs: 1; Ratio - Input:Output: 1:1; Output Configuration: High Side; Output Type: N-Channel; Interface: On/Off; Voltage - Supply (Vcc/Vdd): Not Required; Rds On (Typ): 88 mOhm; Input Type: Non-Inverting; Fault Protection: Current Limiting (Adjustable), Over Temperature, UVLO; Supplier 1: Digi-Key; RoHS: RoHS Compliant; Category: Integrated Circuits (ICs); Stock 1: 7665; Pricing 1: 1=2.71, 10=2.43, 100=1.9491, 500=1.602, 1000=1.3261 (USD); Packaging: Cut Tape (CT); Features: Auto Restart, Power Good, Slew Rate Controlled, Status Flag; Operating Temperature: -40°C ~ 85°C (TA); Supplier Device Package: 8-MLP (3x3); ComponentLink1URL: http://www.fairchildsemi.com/datasheets/FP/FPF2700.pdf; ComponentLink1Description: http://www.fairchildsemi.com/datasheets/FP/FPF2700.pdf; Supplier Part Number 1: FPF2700MPXCT-ND